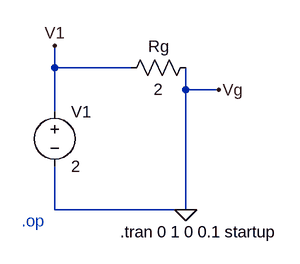
[diagram p0: schematic Draft2.asc]
Draft2.asc, the LTspice schematic file:
Version 4.1
SHEET 1 880 680
WIRE 48 48 48 16
WIRE 160 48 48 48
WIRE 240 80 240 48
WIRE 288 80 240 80
WIRE 48 112 48 48
WIRE 48 256 48 192
WIRE 240 256 240 80
WIRE 240 256 48 256
FLAG 48 16 V1
FLAG 240 256 0
FLAG 288 80 Vg
SYMBOL voltage 48 96 R0
WINDOW 123 0 0 Left 0
WINDOW 39 0 0 Left 0
SYMATTR InstName V1
SYMATTR Value 2
SYMBOL res 256 32 R90
WINDOW 0 0 56 VBottom 2
WINDOW 3 32 56 VTop 2
SYMATTR InstName Rg
SYMATTR Value 2
TEXT 0 272 Left 2 ;.op
TEXT 144 288 Left 2 !.tran 0 1 0 0.1 startup

The netlist it stands for:
* Draft2.asc
V1 V1 0 2
Rg 0 V1 2
* .op
.tran 0 1 0 0.1 startup
.backanno
.end

* Results of the author's LTspice run, read from the files saved beside the schematic
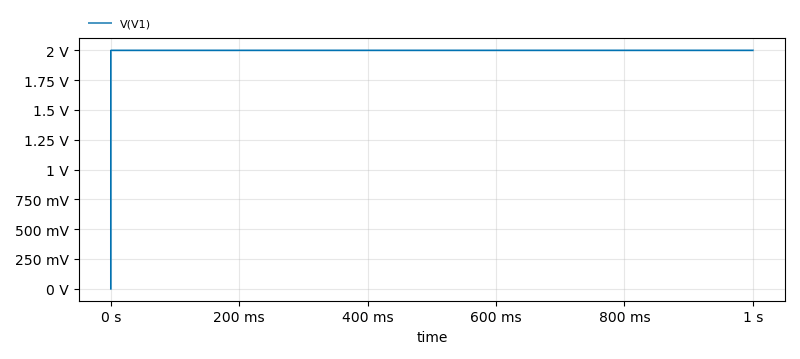
[diagram p1: Transient Analysis of Draft2.asc, plotted from the saved traces]
* Transient Analysis, 1 run:
*   V(V1): min 0 V, max 2 V, average 2 V, rms 2 V, last 2 V